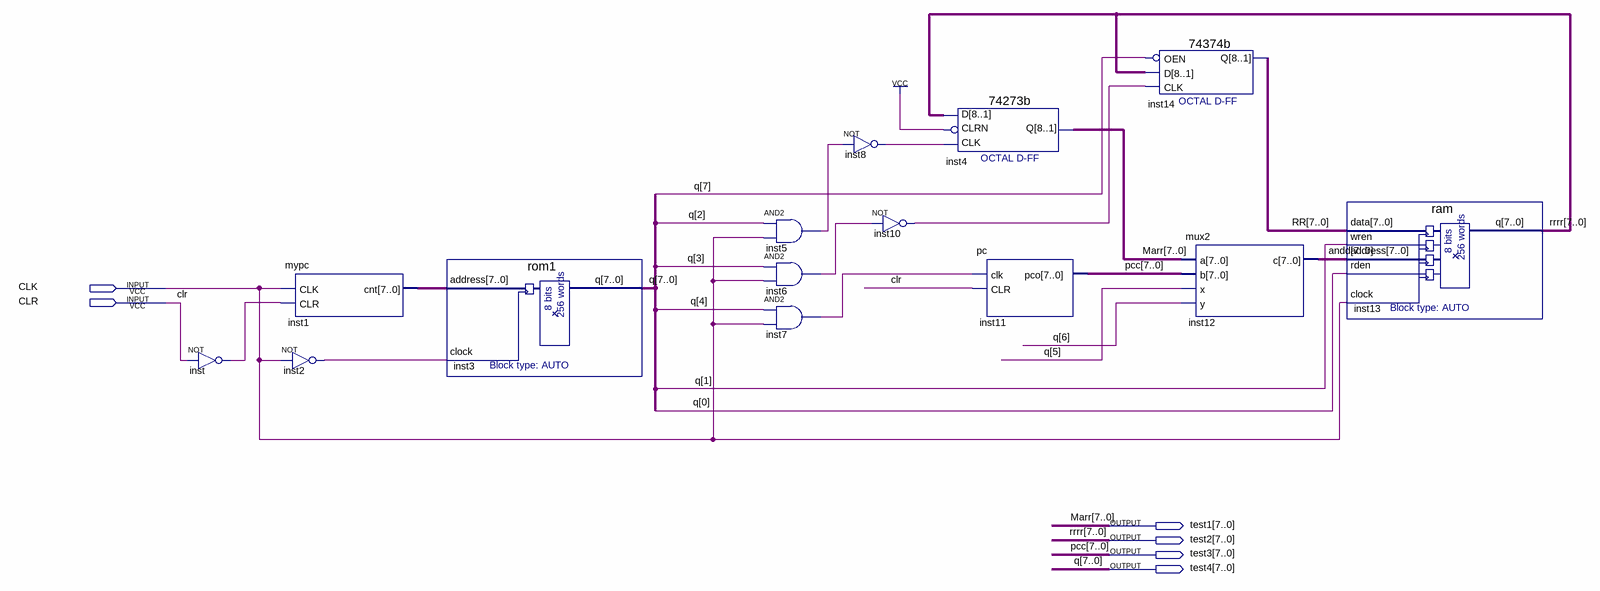
[diagram p0: schematic sheet]
// Quartus schematic ex2.bdf as structural Verilog: 14 symbols, 6 pins
module ex2 (
  input  CLK,
  input  CLR,
  output [7:0] test1,
  output [7:0] test2,
  output [7:0] test3,
  output [7:0] test4
);

  wire inst2_out, inst5_out, inst6_out, inst7_out, inst8_out, inst10_out, inst_out;
  wire [7:0] andd, inst1_cnt, RR;

  not inst (inst_out, CLR);
  mypc inst1 (.CLK(CLK), .CLR(inst_out), .cnt(inst1_cnt));
  not inst2 (inst2_out, CLK);
  rom1 inst3 (.address(inst1_cnt), .clock(inst2_out), .q(test4));
  and inst5 (inst5_out, test4[2], CLK);
  and inst6 (inst6_out, test4[3], CLK);
  and inst7 (inst7_out, test4[4], CLK);
  not inst8 (inst8_out, inst5_out);
  not inst10 (inst10_out, inst6_out);
  \74273b  inst4 (.CLK(inst8_out), .D(test2), .CLRN(1'b1), .Q(test1));
  pc inst11 (.clk(inst7_out), .CLR(CLR), .pco(test3));
  \74374b  inst14 (.D(test2), .OEN(test4[7]), .CLK(inst10_out), .Q(RR));
  mux2 inst12 (.a(test1), .b(test3), .x(test4[5]), .y(test4[6]), .c(andd));
  ram inst13 (.data(RR), .wren(test4[1]), .address(andd), .rden(test4[0]), .clock(CLK), .q(test2));

  // Other names for the same wires on the sheet: Marr[7:0] = test1; pcc[7:0] = test3; q[7:0] = test4;
  //   rrrr[7:0] = test2
endmodule
